# Altium schematic sheet Buck Converter.SchDoc
size A; SheetNumber: 1; SheetTotal: 3
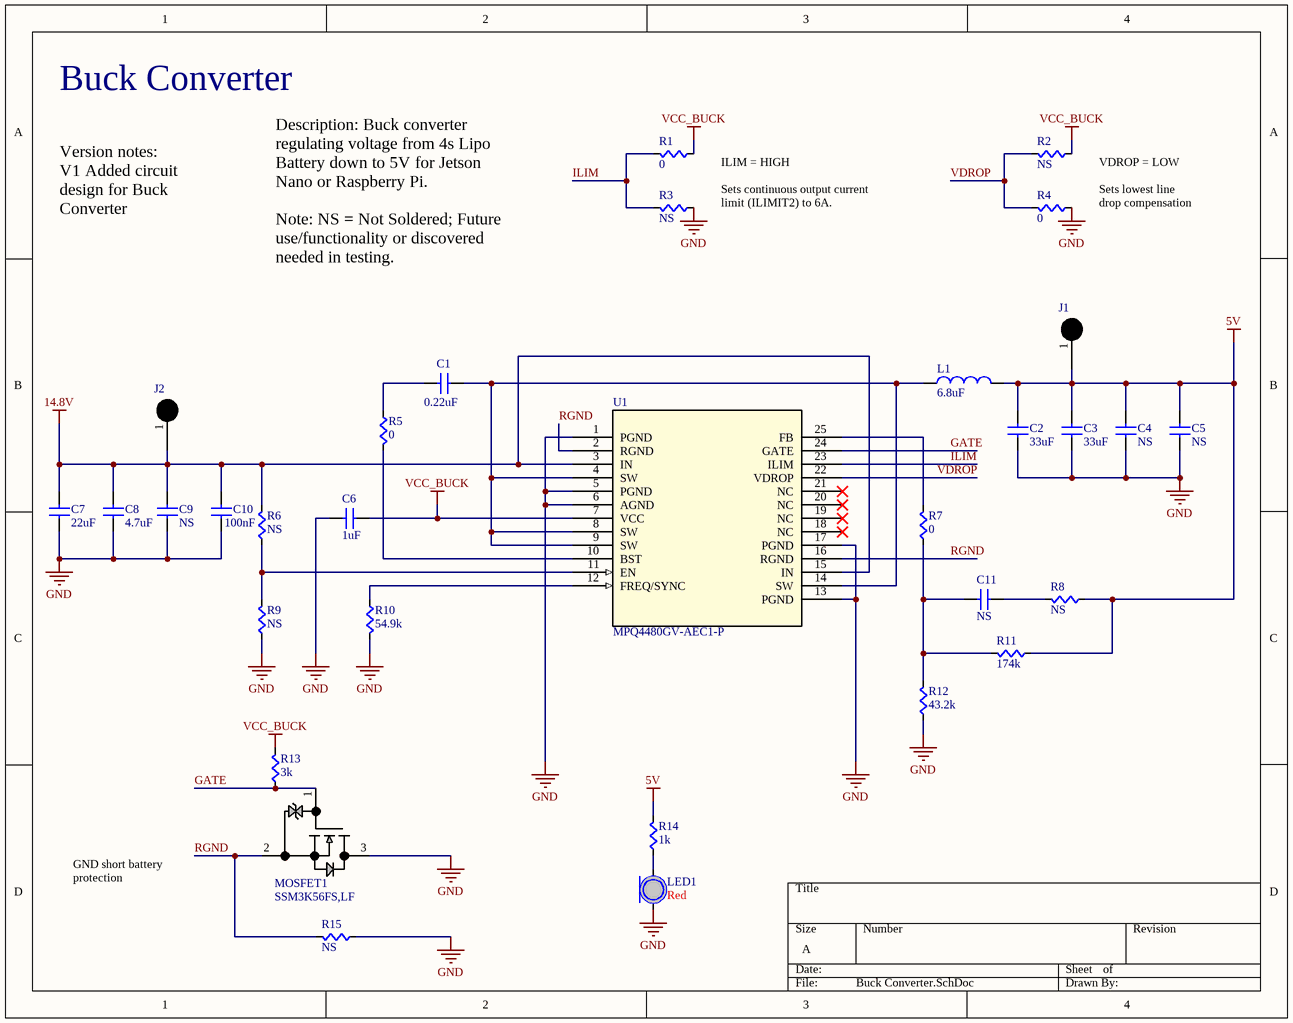
[diagram p0: Buck Converter.SchDoc]

## Parts
C1  value 0.22uF  [CAPC0603]  (hidden comment: C1608X7R1H224K080AE)
C2  value 33uF  [CAP1210]  (hidden comment: C3225X5R1A336M200AC)
C3  value 33uF  [CAP1210]  (hidden comment: C3225X5R1A336M200AC)
C4  value NS  [CAPC1206]  (hidden comment: Cap)
C5  value NS  [CAPC1206]  (hidden comment: Cap)
C6  value 1uF  [CAPC0603]  (hidden comment: CL10A105KB8NNNC)
C7  value 22uF  [CAPC1206]  (hidden comment: CL31A226KAHNNNE)
C8  value 4.7uF  [CAPC1206]  (hidden comment: 885012208094)
C9  value NS  [CAPC1206]  (hidden comment: Cap)
C10  value 100nF  [CAPC0603]  (hidden comment: CL10B104KB8NNNC)
C11  value NS  [CAPC0603]  (hidden comment: Cap)
J1  5000 Test Point  [5000 Test Point]  (value not drawn)
J2  5000 Test Point  [5000 Test Point]  (value not drawn)
L1  Inductance: 6.8uF  [SRR1208 Series]  (hidden comment: SRR1280A-6R8Y)
LED1  Color: Red  [LED1206]  (hidden comment: LED)
MOSFET1  SSM3K56FS,LF  [SSM_TOS]
R1  value 0  [RES0603]  (hidden comment: RMCF0603ZT0R00)
R2  value NS  [RES0603]  (hidden comment: Res)
R3  value NS  [RES0603]  (hidden comment: Res)
R4  value 0  [RES0603]  (hidden comment: RMCF0603ZT0R00)
R5  value 0  [RES0603]  (hidden comment: RMCF0603ZT0R00)
R6  value NS  [RES0603]  (hidden comment: Res)
R7  value 0  [RES0603]  (hidden comment: RMCF0603ZT0R00)
R8  value NS  [RES0603]  (hidden comment: Res)
R9  value NS  [RES0603]  (hidden comment: Res)
R10  value 54.9k  [RES0603]  (hidden comment: RMCF0603FT54K9)
R11  value 174k  [RES0603]  (hidden comment: RC0603FR-07174KL)
R12  value 43.2k  [RES0603]  (hidden comment: RC0603FR-0743K2L)
R13  value 3k  [RES0603]  (hidden comment: RMCF0603FT3K00)
R14  value 1k  [RES0603]  (hidden comment: RC0603FR-071KL)
R15  value NS  [RES0603]  (hidden comment: Res)
U1  MPQ4480GV-AEC1-P  [QFN-25_4X5_MNP]

## Nets
5V: C2.1(A) C3.1(A) C4.1(A) C5.1(A) J1.1 L1.2(B) R8.2(B) R11.2(B) R14.1(A)
14.8V: C7.1(A) C8.1(A) C9.1(A) C10.1(A) J2.1 R6.1(A) U1.3(IN) U1.15(IN)
GND: C2.2(B) C3.2(B) C4.2(B) C5.2(B) C6.2(B) C7.2(B) C8.2(B) C9.2(B) C10.2(B) LED1.C MOSFET1.3 R3.2(B) R4.2(B) R9.2(B) R10.1(A) R12.2(B) R15.2(B) U1.1(PGND) U1.5(PGND) U1.6(AGND) U1.13(PGND) U1.17(PGND)
VCC_BUCK: C6.1(A) R1.2(B) R2.2(B) R13.1(A) U1.7(VCC)
GATE: MOSFET1.1 R13.2(B) U1.24(GATE)
ILIM: R1.1(A) R3.1(A) U1.23(ILIM)
RGND: MOSFET1.2 R15.1(A) U1.2(RGND) U1.16(RGND)
VDROP: R2.1(A) R4.1(A) U1.22(VDROP)
NetC1_1: C1.1(A) R5.2(B)
NetC1_2: C1.2(B) L1.1(A) U1.4(SW) U1.8(SW) U1.9(SW) U1.14(SW)
NetC11_1: C11.1(A) R7.2(B) R11.1(A) R12.1(A)
NetC11_2: C11.2(B) R8.1(A)
NetLED1_A: LED1.A R14.2(B)
NetR5_1: R5.1(A) U1.10(BST)
NetR6_2: R6.2(B) R9.1(A) U1.11(EN)
NetR7_1: R7.1(A) U1.25(FB)
NetR10_2: R10.2(B) U1.12(FREQ/SYNC)

Not connected (* = marked no-connect by the designer): U1 18(NC)* 19(NC)* 20(NC)* 21(NC)*

## Notes on the sheet
- Buck Converter
- ILIM = HIGH
  Sets continuous output current limit (ILIMIT2) to 6A.
- VDROP = LOW
  Sets lowest line drop compensation
- Version notes:
  V1 Added circuit design for Buck Converter
- Description: Buck converter regulating voltage from 4s Lipo Battery down to 5V for Jetson Nano or Raspberry Pi.
  Note: NS = Not Soldered; Future use/functionality or discovered needed in testing.
- GND short battery protection

## Library data of the parts
C1 = C1608X7R1H224K080AE: 0.22 µF ±10% 50V Ceramic Capacitor X7R 0603 (1608 Metric); Supplier 1: Arrow Electronics; Supplier Part Number 1: C1608X7R1H224K080AE; ComponentLink1Description: New link; ComponentLink1URL: *
C2 C3 = C3225X5R1A336M200AC: 33 µF ±20% 10V Ceramic Capacitor X5R 1210 (3225 Metric); Supplier 1: Arrow Electronics; Supplier Part Number 1: C3225X5R1A336M200AC; ComponentLink1Description: New link; ComponentLink1URL: *
C6 = CL10A105KB8NNNC: 1 µF ±10% 50V Ceramic Capacitor X5R 0603 (1608 Metric); Supplier 1: Arrow Electronics; Supplier Part Number 1: CL10A105KB8NNNC; ComponentLink1Description: New link; ComponentLink1URL: *
C7 = CL31A226KAHNNNE: 22 µF ±10% 25V Ceramic Capacitor X5R 1206 (3216 Metric); Supplier 1: Arrow Electronics; Supplier Part Number 1: CL31A226KAHNNNE; ComponentLink1Description: New link; ComponentLink1URL: *
C8 = 885012208094: 4.7 µF ±10% 50V Ceramic Capacitor X7R 1206 (3216 Metric); Supplier 1: Digi-Key; Supplier Part Number 1: 732-7578-1-ND; ComponentLink1Description: New link; ComponentLink1URL: *
C9 = Cap: Not Soldered (NS); ComponentLink1Description: New link; ComponentLink1URL: *
C10 = CL10B104KB8NNNC: 0.1 µF ±10% 50V Ceramic Capacitor X7R 0603 (1608 Metric); Supplier 1: Arrow Electronics; Supplier Part Number 1: CL10B104KB8NNNC; ComponentLink1Description: New link; ComponentLink1URL: *
L1 = SRR1280A-6R8Y: FIXED IND 6.8UH 7.6A 18.5MOHM SM; Manufacturer 1: Bourns Inc; Manufacturer Part Number 1: SRR1280A-6R8Y; Supplier 1: Newark; Supplier Part Number 1: 87X9503
MOSFET1 = SSM3K56FS,LF: No Description Available; Mfr_Name: Toshiba Electronic Devices & Storage Corp.; Copyright: Copyright (C) 2023 Ultra Librarian. All rights reserved.; Manufacturer_Part_Number: SSM3K56FS,LF; RefDes: RefDes; Type: DEV
R1 R4 R5 R7 = RMCF0603ZT0R00: 0 Ohms Jumper Chip Resistor 0603 (1608 Metric) Automotive AEC-Q200 Thick Film; Supplier 1: Arrow Electronics; Supplier Part Number 1: RMCF0603ZT0R00
R10 = RMCF0603FT54K9: 54.9 kOhms ±1% 0.1W, 1/10W Chip Resistor 0603 (1608 Metric) Automotive AEC-Q200 Thick Film; Supplier 1: Arrow Electronics; Supplier Part Number 1: RMCF0603FT54K9
R11 = RC0603FR-07174KL: 174 kOhms ±1% 0.1W, 1/10W Chip Resistor 0603 (1608 Metric) Moisture Resistant Thick Film; Supplier 1: Future Electronics; Supplier Part Number 1: 4022323
R12 = RC0603FR-0743K2L: 43.2 kOhms ±1% 0.1W, 1/10W Chip Resistor 0603 (1608 Metric) Moisture Resistant Thick Film; Supplier 1: Future Electronics; Supplier Part Number 1: 3526589
R13 = RMCF0603FT3K00: 3 kOhms ±1% 0.1W, 1/10W Chip Resistor 0603 (1608 Metric) Automotive AEC-Q200 Thick Film; Supplier 1: Arrow Electronics; Supplier Part Number 1: RMCF0603FT3K00
R14 = RC0603FR-071KL: 1 kOhms ±1% 0.1W, 1/10W Chip Resistor 0603 (1608 Metric) Moisture Resistant Thick Film; Supplier 1: Future Electronics; Supplier Part Number 1: 4016291; Parameter 1: *
U1 = MPQ4480GV-AEC1-P: No Description Available; Mfr_Name: Monolithic Power Systems; Copyright: Copyright (C) 2023 Ultra Librarian. All rights reserved.; Manufacturer_Part_Number: MPQ4480GV-AEC1-P; Digi-Key_Part_Number_1: 1589-MPQ4480GV-AEC1-PTR-ND; Digi-Key_Part_Number_2: 1589-MPQ4480GV-AEC1-PCT-ND; Digi-Key_Part_Number_3: 1589-MPQ4480GV-AEC1-PDKR-ND; RefDes: RefDes; Type: DEV
C4 C5 C11 = Cap: Supplier 1: Digi-Key; Supplier Part Number 1: 1276-1000-1-ND; ComponentLink1Description: New link; ComponentLink1URL: *
LED1 = LED: Supplier 1: Digi-Key; Supplier Part Number 1: 1080-1419-1-ND
R2 R3 R6 R8 R9 R15 = Res: Supplier 1: Digi-Key; Supplier Part Number 1: RMCF0603JT10K0CT-ND